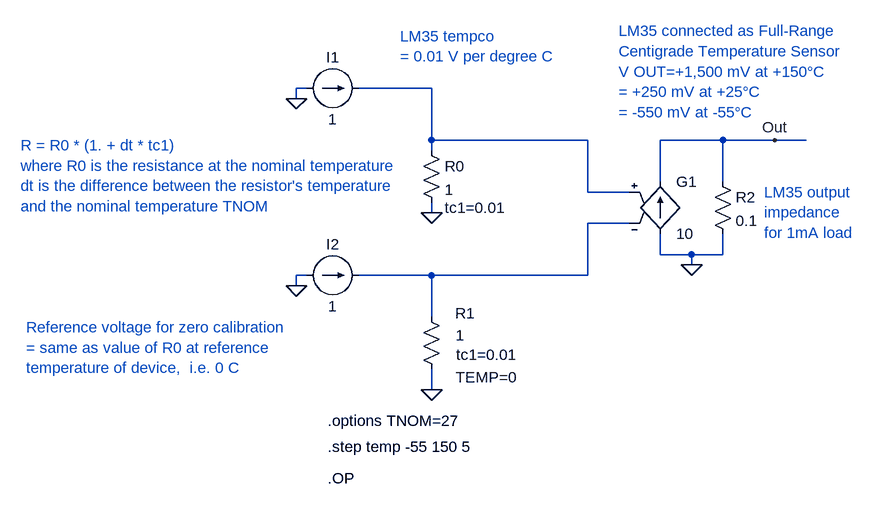
[diagram p0: schematic tempsens.asc]
tempsens.asc, the LTspice schematic file:
Version 4
SHEET 1 2344 1864
WIRE 976 1152 976 1136
WIRE 976 1440 976 1424
WIRE 992 1136 976 1136
WIRE 992 1424 976 1424
WIRE 1184 1136 1072 1136
WIRE 1184 1216 1184 1136
WIRE 1184 1232 1184 1216
WIRE 1184 1328 1184 1312
WIRE 1184 1424 1072 1424
WIRE 1184 1488 1184 1424
WIRE 1184 1600 1184 1568
WIRE 1424 1216 1184 1216
WIRE 1424 1296 1424 1216
WIRE 1424 1424 1184 1424
WIRE 1424 1424 1424 1344
WIRE 1488 1296 1424 1296
WIRE 1488 1344 1424 1344
WIRE 1536 1280 1536 1216
WIRE 1536 1392 1536 1360
WIRE 1584 1392 1536 1392
WIRE 1584 1408 1584 1392
WIRE 1632 1216 1536 1216
WIRE 1632 1280 1632 1216
WIRE 1632 1392 1584 1392
WIRE 1632 1392 1632 1360
WIRE 1712 1216 1632 1216
WIRE 1760 1216 1712 1216
FLAG 1712 1216 Out
FLAG 976 1152 0
FLAG 976 1440 0
FLAG 1184 1328 0
FLAG 1184 1600 0
FLAG 1584 1408 0
SYMBOL res 1168 1216 R0
WINDOW 123 36 104 Left 0
SYMATTR Value2 tc1=0.01
SYMATTR InstName R0
SYMATTR Value 1
SYMBOL g 1536 1264 R0
SYMATTR InstName G1
SYMATTR Value 10
SYMBOL res 1616 1264 R0
SYMATTR InstName R2
SYMATTR Value 0.1
SYMBOL current 992 1136 R270
WINDOW 0 32 40 VTop 0
WINDOW 3 -32 40 VBottom 0
SYMATTR InstName I1
SYMATTR Value 1
SYMBOL res 1168 1472 R0
WINDOW 123 54 74 Left 0
WINDOW 0 52 10 Left 0
WINDOW 3 53 44 Left 0
WINDOW 39 53 109 Left 0
SYMATTR Value2 tc1=0.01
SYMATTR InstName R1
SYMATTR Value 1
SYMATTR SpiceLine TEMP=0
SYMBOL current 992 1424 R270
WINDOW 0 32 40 VTop 0
WINDOW 3 -32 40 VBottom 0
SYMATTR InstName I2
SYMATTR Value 1
TEXT 1024 1688 Left 0 !.step temp -55 150 5
TEXT 1024 1648 Left 0 !.options TNOM=27
TEXT 560 1504 Left 0 ;Reference voltage for zero calibration\n= same as value of R0 at reference\ntemperature of device,  i.e. 0 C
TEXT 552 1224 Left 0 ;R = R0 * (1. + dt * tc1)\nwhere R0 is the resistance at the nominal temperature\ndt is the difference between the resistor's temperature\nand the nominal temperature TNOM
TEXT 1472 1048 Left 0 ;LM35 connected as Full-Range \nCentigrade Temperature Sensor\nV OUT=+1,500 mV at +150°C\n= +250 mV at +25°C\n= -550 mV at -55°C
TEXT 1696 1296 Left 0 ;LM35 output\nimpedance\nfor 1mA load
TEXT 1024 1736 Left 0 !.OP
TEXT 1136 1056 Left 0 ;LM35 tempco\n= 0.01 V per degree C

The netlist it stands for:
* tempsens.asc
R0 N001 0 1 tc1=0.01
G1 0 Out N001 N002 10
R2 Out 0 0.1
I1 0 N001 1
R1 N002 0 1 tc1=0.01 TEMP=0
I2 0 N002 1
.step temp -55 150 5
.options TNOM=27
* Reference voltage for zero calibration
* = same as value of R0 at reference
* temperature of device,  i.e. 0 C
* R = R0 * (1. + dt * tc1)
* where R0 is the resistance at the nominal temperature
* dt is the difference between the resistor's temperature
* and the nominal temperature TNOM
* LM35 connected as Full-Range
* Centigrade Temperature Sensor
* V OUT=+1,500 mV at +150°C
* = +250 mV at +25°C
* = -550 mV at -55°C
* LM35 output
* impedance
* for 1mA load
.OP
* LM35 tempco
* = 0.01 V per degree C
.backanno
.end